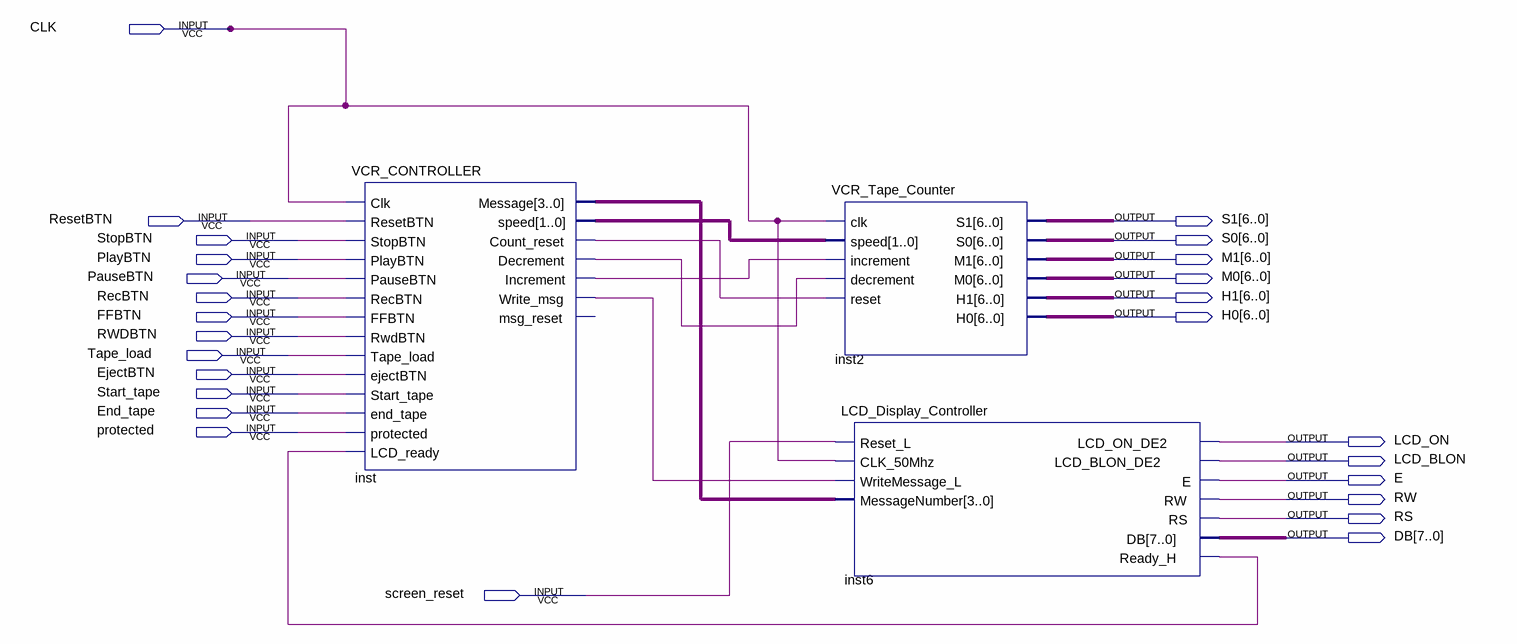
[diagram p0: schematic sheet]
// Quartus schematic Top_level_VCR.bdf as structural Verilog: 3 symbols, 26 pins
module Top_level_VCR (
  input  CLK,
  input  ResetBTN,
  input  StopBTN,
  input  PlayBTN,
  input  PauseBTN,
  input  RecBTN,
  input  FFBTN,
  input  RWDBTN,
  input  Tape_load,
  input  EjectBTN,
  input  Start_tape,
  input  End_tape,
  input  \protected ,
  input  screen_reset,
  output [6:0] S1,
  output [6:0] S0,
  output [6:0] M1,
  output [6:0] M0,
  output [6:0] H1,
  output [6:0] H0,
  output LCD_ON,
  output LCD_BLON,
  output E,
  output RW,
  output RS,
  output [7:0] DB
);

  wire inst6_ready_h, inst_count_reset, inst_decrement, inst_increment, inst_write_msg;
  wire [1:0] inst_speed;
  wire [3:0] inst_message;

  VCR_CONTROLLER inst (
    .Clk(CLK), .ResetBTN(ResetBTN), .StopBTN(StopBTN), .PlayBTN(PlayBTN), .PauseBTN(PauseBTN),
    .RecBTN(RecBTN), .FFBTN(FFBTN), .RwdBTN(RWDBTN), .Tape_load(Tape_load), .ejectBTN(EjectBTN),
    .Start_tape(Start_tape), .end_tape(End_tape), .\protected (\protected ), .LCD_ready(inst6_ready_h),
    .Message(inst_message), .speed(inst_speed), .Count_reset(inst_count_reset), .Decrement(inst_decrement),
    .Increment(inst_increment), .Write_msg(inst_write_msg));  // open: msg_reset
  VCR_Tape_Counter inst2 (
    .clk(CLK), .speed(inst_speed), .increment(inst_increment), .decrement(inst_decrement),
    .reset(inst_count_reset), .S1(S1), .S0(S0), .M1(M1), .M0(M0), .H1(H1), .H0(H0));
  LCD_Display_Controller inst6 (
    .Reset_L(screen_reset), .CLK_50Mhz(CLK), .WriteMessage_L(inst_write_msg), .MessageNumber(inst_message),
    .LCD_ON_DE2(LCD_ON), .LCD_BLON_DE2(LCD_BLON), .E(E), .RW(RW), .RS(RS), .DB(DB), .Ready_H(inst6_ready_h));
endmodule
